# EAGLE design w076oAsBuilt (EAGLE 6.6.0)
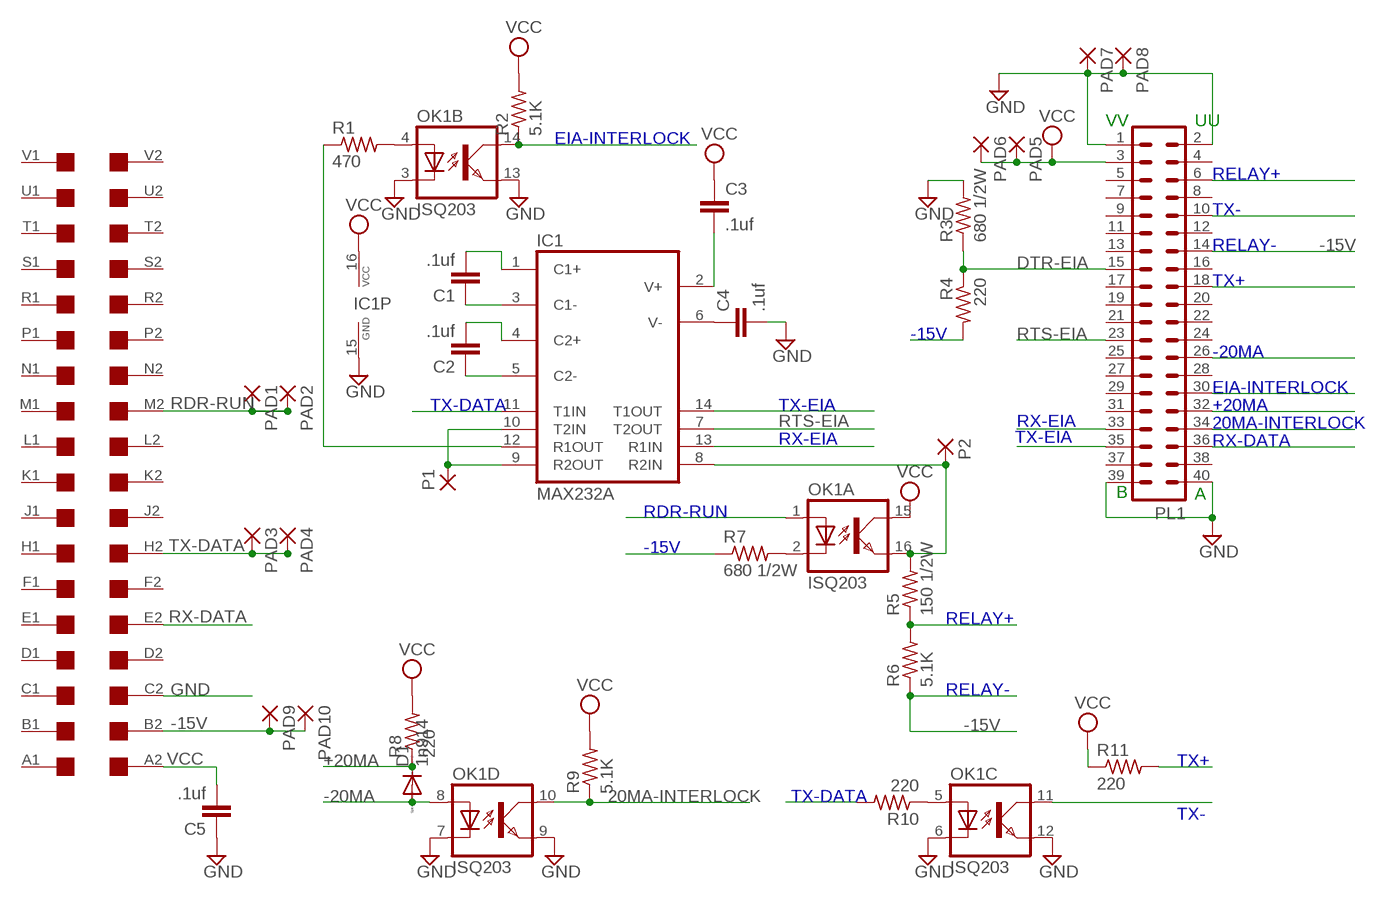
[diagram p0: schematic, sheet 1]

## Parts
C1  .1uf  C-EU050-025X075  [C050-025X075]
C2  .1uf  C-EU050-025X075  [C050-025X075]
C3  .1uf  C-EU050-025X075  [C050-025X075]
C4  .1uf  C-EU050-025X075  [C050-025X075]
C5  .1uf  C-EU050-025X075  [C050-025X075]
D1  1n914  1N4004  [DO41-10]
IC1  MAX232A  MAX232  [DIL16]
OK1  ISQ203  ILQ1  [DIL16]
P1  1,6/0,8  [1,6/0,8]
P2  1,6/0,8  [1,6/0,8]
PAD1  1,6/0,8  [1,6/0,8]
PAD2  1,6/0,8  [1,6/0,8]
PAD3  1,6/0,8  [1,6/0,8]
PAD4  1,6/0,8  [1,6/0,8]
PAD5  1,6/0,8  [1,6/0,8]
PAD6  1,6/0,8  [1,6/0,8]
PAD7  1,6/0,8  [1,6/0,8]
PAD8  1,6/0,8  [1,6/0,8]
PAD9  1,6/0,8  [1,6/0,8]
PAD10  1,6/0,8  [1,6/0,8]
PL1  40H  [40H]
R1  470  R-US_0207/10  [0207/10]
R2  5.1K  R-US_0207/10  [0207/10]
R3  680 1/2W  R-US_0207/12  [0207/12]
R4  220  R-US_0207/10  [0207/10]
R5  150 1/2W  R-US_0207/12  [0207/12]
R6  5.1K  R-US_0207/10  [0207/10]
R7  680 1/2W  R-US_0207/12  [0207/12]
R8  220  R-US_0207/10  [0207/10]
R9  5.1K  R-US_0207/10  [0207/10]
R10  220  R-US_0207/10  [0207/10]
R11  220  R-US_0207/10  [0207/10]
U$1  DEC-FLIPCHIP  [DEC-FLIPCHIP]

## Nets
20MA-INTERLOCK: OK1.10(D:COL) PL1.34 R9.1
+20MA: D1.C PL1.32 R8.1
-15V: PAD9.1(P) PAD10.1(P) PL1.14 R4.2 R6.1 R7.1 U$1.B2
-20MA: D1.A OK1.8(D:A) PL1.26
DTR-EIA: PL1.15 R3.1 R4.1
EIA-INTERLOCK: OK1.14(B:COL) PL1.30 R2.1
GND: C4.2 C5.1 IC1.15(GND) OK1.3(B:C) OK1.6(C:C) OK1.7(D:C) OK1.9(D:EMIT) OK1.12(C:EMIT) OK1.13(B:EMIT) PAD7.1(P) PAD8.1(P) PL1.1 PL1.2 PL1.39 PL1.40 R3.2 U$1.C2
N$1: C2.1 IC1.5(C2-)
N$2: C2.2 IC1.4(C2+)
N$3: C1.2 IC1.1(C1+)
N$4: C1.1 IC1.3(C1-)
N$5: OK1.2(A:C) R7.2
N$6: IC1.9(R2OUT) IC1.10(T2IN) P1.1(P)
N$7: IC1.8(R2IN) OK1.16(A:EMIT) P2.1(P) R5.2
N$8: IC1.12(R1OUT) R1.1
N$9: C3.2 IC1.2(V+)
N$10: C4.1 IC1.6(V-)
N$11: OK1.4(B:A) R1.2
N$15: OK1.5(C:A) R10.1
RDR-RUN: OK1.1(A:A) PAD1.1(P) PAD2.1(P) U$1.M2
RELAY+: PL1.6 R5.1 R6.2
RTS-EIA: IC1.7(T2OUT) PL1.23
RX-DATA: PL1.36 U$1.E2
RX-EIA: IC1.13(R1IN) PL1.33
TX+: PL1.18 R11.2
TX-: OK1.11(C:COL) PL1.10
TX-DATA: IC1.11(T1IN) PAD3.1(P) PAD4.1(P) R10.2 U$1.H2
TX-EIA: IC1.14(T1OUT) PL1.35
VCC: C3.1 C5.2 IC1.16(VCC) OK1.15(A:COL) PAD5.1(P) PAD6.1(P) PL1.3 R2.2 R8.2 R9.2 R11.1 U$1.A2
Unconnected: PL1.4 PL1.5 PL1.7 PL1.8 PL1.9 PL1.11 PL1.12 PL1.13 PL1.16 PL1.17 PL1.19 PL1.20 PL1.21 PL1.22 PL1.24 PL1.25 PL1.27 PL1.28 PL1.29 PL1.31 PL1.37 PL1.38 U$1.A1 U$1.B1 U$1.C1 U$1.D1 U$1.D2 U$1.E1 U$1.F1 U$1.F2 U$1.H1 U$1.J1 U$1.J2 U$1.K1 U$1.K2 U$1.L1 U$1.L2 U$1.M1 U$1.N1 U$1.N2 U$1.P1 U$1.P2 U$1.R1 U$1.R2 U$1.S1 U$1.S2 U$1.T1 U$1.T2 U$1.U1 U$1.U2 U$1.V1 U$1.V2

## Notes on the sheet
- VV | UU
- EIA-INTERLOCK
- RELAY+
- TX-
- RELAY-
- TX+
- -15V
- -20MA
- EIA-INTERLOCK
- TX-DATA | TX-EIA | +20MA
- RX-EIA | 20MA-INTERLOCK
- RX-EIA | TX-EIA | RX-DATA
- B | A
- RDR-RUN
- -15V
- RELAY+
- RELAY-
- TX+
- TX-DATA
- TX-

## Library data of the parts
C1-C5 = rcl:C-EU: CAPACITOR, European symbol
D1 = diode:1N4004: DIODE general purpose rectifier, 1 A
IC1 = maxim:MAX232: RS232 TRANSCEIVER; MF: MAXIM; MPN: MAX232ACPE+; OC_FARNELL: 9723773; OC_NEWARK: 68K4544
OK1 = optocoupler:ILQ1: SIEMENS OPTO COUPLER; MF: VISHAY/TELEFUNKEN; MPN: ILQ1; OC_FARNELL: 1469501; OC_NEWARK: 88K1954
P1 P2 PAD1-PAD10 = wirepad:1,6/0,8: THROUGH-HOLE PAD
PL1 = con-harting-h:40H: CONNECTOR; OC_FARNELL: unknown; OC_NEWARK: unknown
R1-R11 = rcl:R-US_: RESISTOR, American symbol
U$1 = con-dec:DEC-FLIPCHIP: DEC Flip-Chip single card fingers

## Board
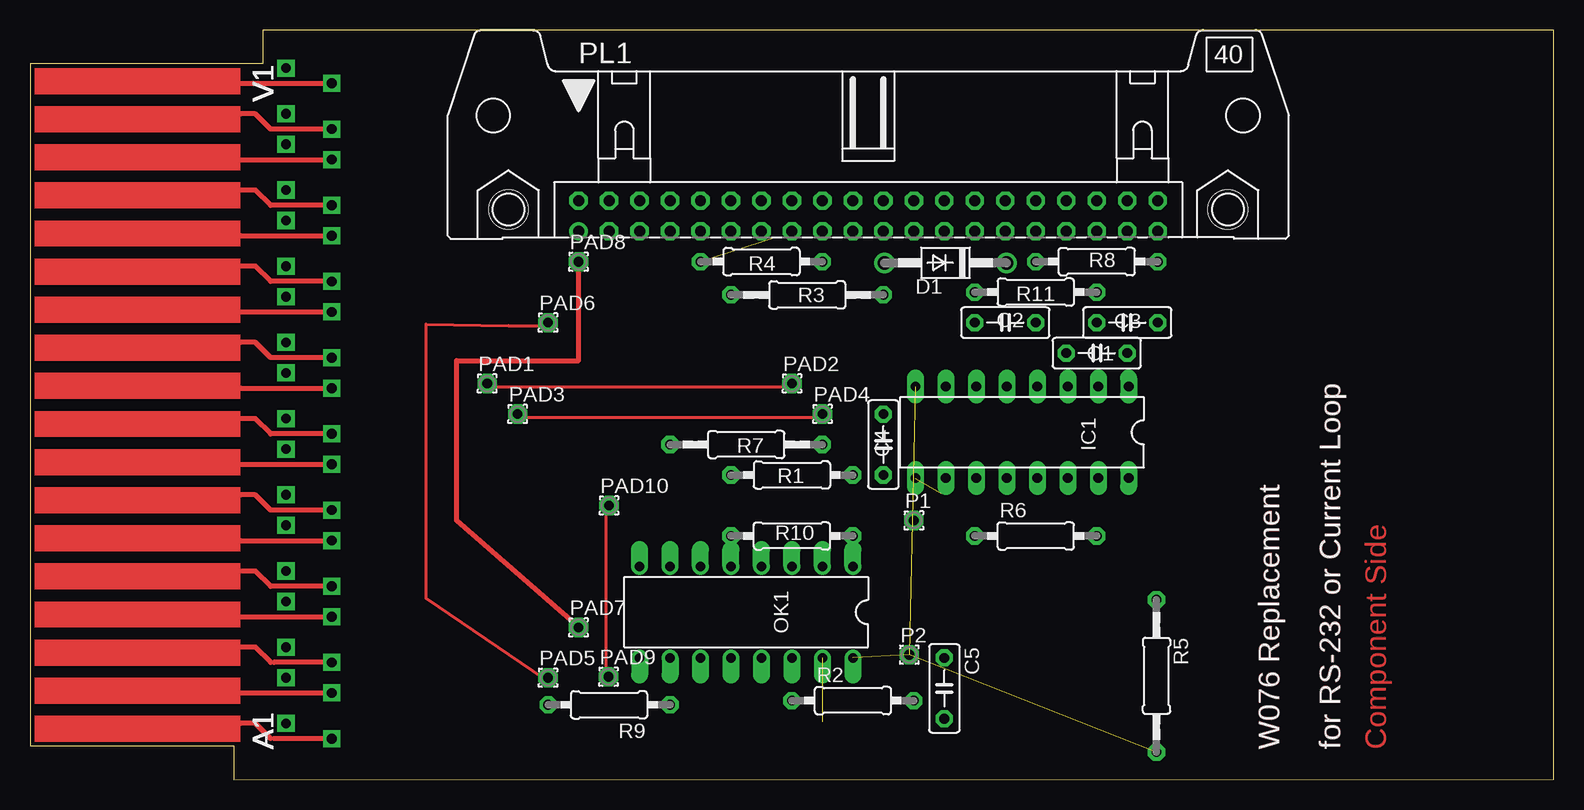
[diagram p1: board, top side]
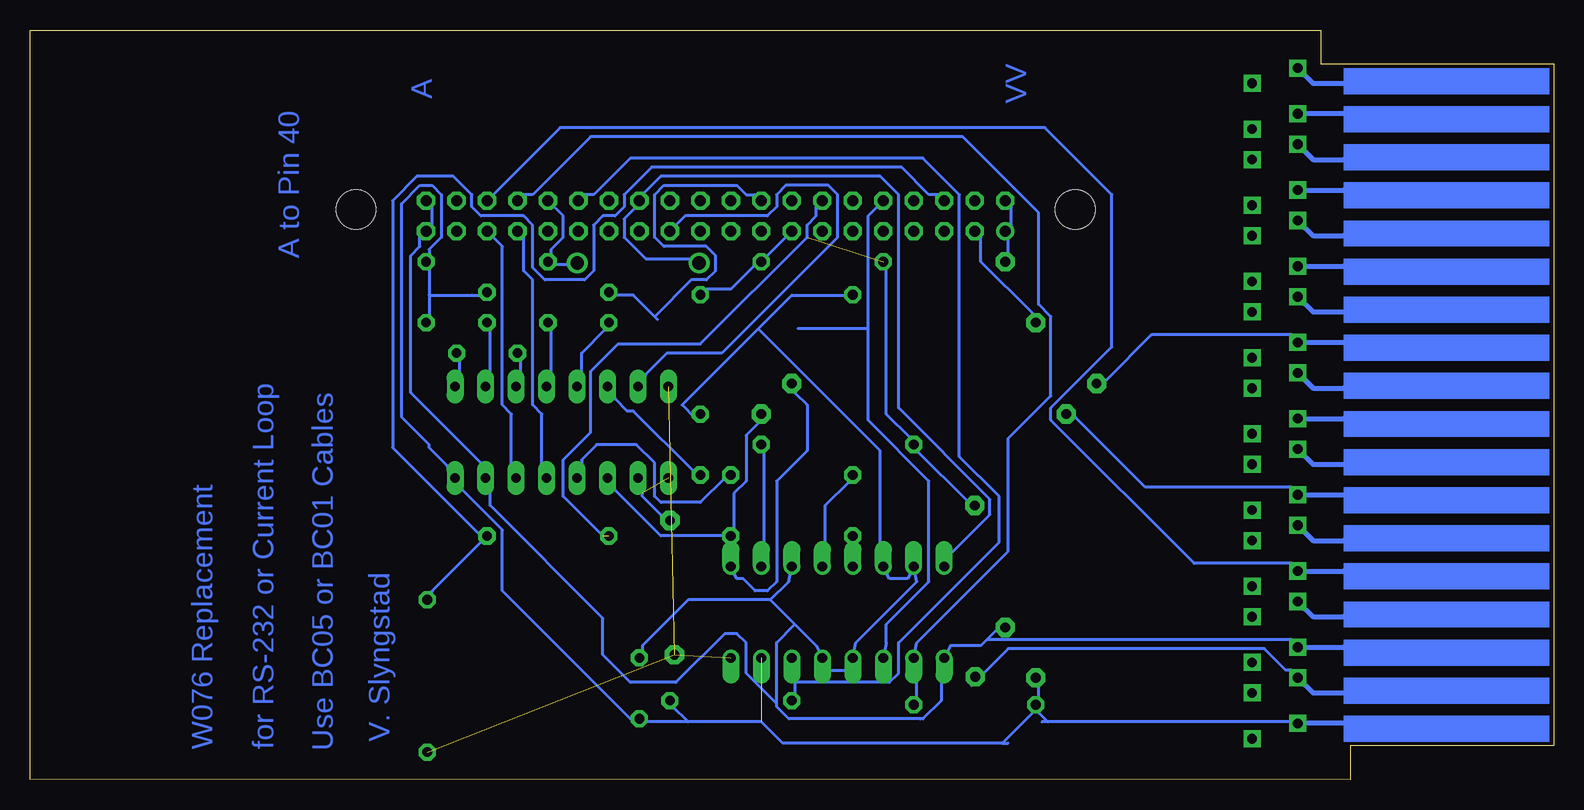
[diagram p2: board, bottom side, seen from below]

Size 126.98 x 62.48 mm. Coordinates in mm from the lower left corner, seen from the top.
Outline: 0,2.83 16.96,2.83 16.96,0 126.98,0.04 126.98,62.45 19.4,62.48 19.4,59.65 0,59.65 0,2.83
Copper layers (1*16): Top 0.035mm / dielectric 1.5mm / Bottom 0.035mm
Design rules "10mils": minimum track width 10mil, minimum drill 28mil, track to track 15mil, track to pad 10mil, pad to pad 10mil, via to via 10mil, smd to smd 10mil, copper to edge 40mil, drill to drill 10mil, minimum pad ring 12mil, minimum via ring 8mil, stop-mask expansion 0mil, vias tented up to drill 0mil, thermal gap 10mil

### Footprints (pad centres in the part's own frame; a part is rotated, then mirrored left to right if it is on the bottom)
C050-025X075 = drill 0.813 octagon: 1 -2.54,0; 2 2.54,0
DO41-10 = drill 1.118: A 5.08,0; C -5.08,0
DIL16 = drill 0.813 long: 1 -8.89,-3.81; 2 -6.35,-3.81; 3 -3.81,-3.81; 4 -1.27,-3.81; 5 1.27,-3.81; 6 3.81,-3.81; 7 6.35,-3.81; 8 8.89,-3.81; 9 8.89,3.81; 10 6.35,3.81; 11 3.81,3.81; 12 1.27,3.81; 13 -1.27,3.81; 14 -3.81,3.81; 15 -6.35,3.81; 16 -8.89,3.81
DIL16' = drill 0.813 offset: 1 -8.89,-3.81; 2 -6.35,-3.81; 3 -3.81,-3.81; 4 -1.27,-3.81; 5 1.27,-3.81; 6 3.81,-3.81; 7 6.35,-3.81; 8 8.89,-3.81; 9 8.89,3.81; 10 6.35,3.81; 11 3.81,3.81; 12 1.27,3.81; 13 -1.27,3.81; 14 -3.81,3.81; 15 -6.35,3.81; 16 -8.89,3.81
1,6/0,8 = drill 0.813 pad 1.6 octagon: 1 0,0
40H = drill 0.914: 1 -24.13,-1.27 | drill 0.914 octagon: 2 -24.13,1.27; 3 -21.59,-1.27; 4 -21.59,1.27; 5 -19.05,-1.27; 6 -19.05,1.27; 7 -16.51,-1.27; 8 -16.51,1.27; 9 -13.97,-1.27; 10 -13.97,1.27; 11 -11.43,-1.27; 12 -11.43,1.27; 13 -8.89,-1.27; 14 -8.89,1.27; 15 -6.35,-1.27; 16 -6.35,1.27; 17 -3.81,-1.27; 18 -3.81,1.27; 19 -1.27,-1.27; 20 -1.27,1.27; 21 1.27,-1.27; 22 1.27,1.27; 23 3.81,-1.27; 24 3.81,1.27; 25 6.35,-1.27; 26 6.35,1.27; 27 8.89,-1.27; 28 8.89,1.27; 29 11.43,-1.27; 30 11.43,1.27; 31 13.97,-1.27; 32 13.97,1.27; 33 16.51,-1.27; 34 16.51,1.27; 35 19.05,-1.27; 36 19.05,1.27; 37 21.59,-1.27; 38 21.59,1.27; 39 24.13,-1.27; 40 24.13,1.27 | hole 3.302: -29.972,0.533; 29.972,0.533
0207/10 = drill 0.813 octagon: 1 -5.08,0; 2 5.08,0
0207/12 = drill 0.813 octagon: 1 -6.35,0; 2 6.35,0
DEC-FLIPCHIP = drill 0.813 square: A1 -7.62,27.94; A2 -3.81,26.67; B1 -7.62,24.13; B2 -3.81,22.86; C1 -7.62,21.59; C2 -3.81,20.32; D1 -7.62,17.78; D2 -3.81,16.51; E1 -7.62,15.24; E2 -3.81,13.97; F1 -7.62,11.43; F2 -3.81,10.16; H1 -7.62,8.89; H2 -3.81,7.62; J1 -7.62,5.08; J2 -3.81,3.81; K1 -7.62,2.54; K2 -3.81,1.27; L1 -7.62,-1.27; L2 -3.81,-2.54; M1 -7.62,-3.81; M2 -3.81,-5.08; N1 -7.62,-7.62; N2 -3.81,-8.89; P1 -7.62,-10.16; P2 -3.81,-11.43; R1 -7.62,-13.97; R2 -3.81,-15.24; S1 -7.62,-16.51; S2 -3.81,-17.78; T1 -7.62,-20.32; T2 -3.81,-21.59; U1 -7.62,-22.86; U2 -3.81,-24.13; V1 -7.62,-26.67; V2 -3.81,-27.94

### Placement (x,y rotation side)
C1  88.9,35.56 0 top
C2  81.28,38.1 0 top
C3  91.44,38.1 180 top
C4  71.12,27.94 90 top
C5  76.2,7.62 270 top
D1  76.3,43.08 180 top
IC1  82.67,28.96 180 top
OK1  ISQ203  [DIL16']  59.68,13.97 180 top
P1  73.66,21.62 0 top
P2  73.27,10.41 0 top
PAD1  38.09,33.02 0 top
PAD2  63.49,33.02 0 top
PAD3  40.63,30.48 0 top
PAD4  66.04,30.48 0 top
PAD5  43.17,8.51 0 top
PAD6  43.17,38.1 0 top
PAD7  45.71,12.7 0 top
PAD8  45.71,43.18 0 top
PAD9  48.2,8.59 0 top
PAD10  48.25,22.86 0 top
PL1  69.84,46.99 0 top
R1  63.49,25.4 180 top
R2  68.58,6.6 0 top
R3  64.77,40.41 180 top
R4  60.95,43.18 180 top
R5  93.87,8.66 270 top
R6  83.81,20.32 0 top
R7  59.68,27.94 0 top
R8  88.9,43.18 0 top
R9  48.25,6.25 180 top
R10  63.49,20.32 0 top
R11  83.81,40.64 180 top
U$1  17.52,31.37 180 top

### Tracks (layer width: path | path; a pad name or v marks a point on that pad's centre or on a via)
20MA-INTERLOCK
  Bottom 0.254: PL1.34 85.85,48.77 85.09,48.77 80.26,53.59 49.27,53.59 42.92,47.24 42.92,39.62 41.9,38.61 41.9,32 45.46,28.45 45.46,19.05 53.08,11.43 OK1.10 53.08,8.89 53.08,6.86 R9.1
+20MA
  Bottom 0.254: PL1.32 82.55,46.99 82.55,45.21 83.56,44.2 83.56,43.69 R8.1 83.31,42.93 82.04,42.93 D1.C
-15V  (2 unrouted)
  Top 0.254: PAD9.1 48,8.38 48,22.1 PAD10.1
  Bottom 0.254: PAD10.1 48.76,23.11 53.08,27.43 R7.1 53.59,28.45 55.62,30.48 55.62,42.67 R4.2 | U$1.B2 21.84,9.14 22.35,9.14 24.12,10.92 45.46,10.92 47.49,8.89 PAD9.1 | PAD9.1 48.76,8.13 | PAD9.1 48.51,7.87 | 78.23,20.07 R6.1 78.48,19.81 | 79.24,20.32 82.55,23.62 82.55,26.67 80.26,28.96 80.26,34.04 77.97,36.32 71.12,36.32 62.22,45.21 62.22,46.23 61.46,46.99 61.46,47.75 PL1.14
-20MA
  Bottom 0.254: OK1.8 50.29,18.8 46.98,22.1 46.98,23.37 54.6,30.99 54.6,48.77 56.13,50.29 74.42,50.29 75.94,48.77 PL1.26 76.45,47.75 77.47,46.74 77.47,45.21 75.69,43.43 71.88,43.43 D1.A
DTR-EIA
  Bottom 0.254: PL1.15 R4.1 66.54,42.93 68.58,40.89 70.61,40.89 R3.1
EIA-INTERLOCK
  Bottom 0.254: 63.24,8.13 63.24,8.89 OK1.14 | 63.24,8.13 55.37,8.13 54.6,8.89 54.6,11.43 46.22,19.81 46.22,23.62 49.52,26.92 49.52,48.77 52.57,51.82 76.96,51.82 80.01,48.77 80.77,48.77 PL1.30 | 63.24,8.13 63.24,7.11 R2.1
GND
  Top 0.406: PAD8.1 45.71,34.92 35.55,34.92 35.55,21.59 PAD7.1
  Bottom 0.254: 70.61,30.23 C4.2 71.62,30.23 72.64,31.24 66.29,37.59 | 47.24,11.68 46.48,12.45 PAD7.1 | 47.24,11.68 47.75,11.18 50.29,11.18 OK1.9 51.05,8.89 51.05,6.6 52.57,5.08 52.83,5.08 | 47.24,11.68 21.84,11.68 U$1.C2 | PL1.40 93.47,47.75 93.47,46.23 PL1.39 94.48,45.21 94.48,44.45 95.25,43.69 95.25,32.26 89.4,26.42 IC1.15 88.64,23.88 88.64,22.86 79.24,13.46 79.24,10.41 76.96,8.13 73.15,8.13 69.08,12.19 68.07,12.19 67.31,11.43 67.31,8.89 64.77,6.35 | PAD8.1 45.46,43.94 45.46,45.21 PL1.1 45.21,46.23 45.21,47.75 PL1.2 | 66.29,37.59 63.49,40.39 58.92,40.39 R3.2 | 66.29,37.59 56.13,27.43 56.13,19.05 OK1.6 55.37,16.76 53.84,16.76 OK1.7 53.08,16.51 58.16,11.43 OK1.12 58.92,9.14 60.45,9.14 OK1.13 61.46,11.18 63.24,12.95 | 65.27,14.99 72.13,14.99 75.94,11.18 75.94,10.67 C5.1 | 65.27,14.99 63.75,16.51 OK1.3 | 63.24,12.95 65.27,14.99 | 63.24,12.95 64.77,11.43 64.77,6.35 | 64.77,6.35 64.77,6.1 63.75,5.08 52.83,5.08 | 52.83,5.08 52.75,5.11
N$1
  Bottom 0.254: IC1.5 81.02,34.04 81.02,35.56 78.99,37.59 C2.1
N$2
  Bottom 0.254: IC1.4 83.56,34.04 83.56,37.59 C2.2
N$3
  Bottom 0.254: IC1.1 91.18,34.04 91.18,35.05 C1.2
N$4
  Bottom 0.254: IC1.3 86.1,34.04 86.1,35.05 C1.1
N$5
  Bottom 0.254: OK1.2 65.78,19.05 65.78,27.43 R7.2
N$6  (1 unrouted)
  Bottom 0.254: IC1.10 75.94,23.88 75.94,23.62 74.16,21.84 P1.1
N$7  (3 unrouted)
N$8
  Bottom 0.254: IC1.12 81.02,26.42 81.02,26.67 79.75,27.94 76.45,27.94 74.93,26.42 74.93,23.62 74.42,23.11 71.12,23.11 69.08,25.15 R1.1
N$9
  Bottom 0.254: IC1.2 88.64,34.04 88.64,37.59 C3.2
N$10
  Bottom 0.254: C4.1 71.62,25.65 76.7,30.73 77.21,30.73 78.23,31.75 IC1.6
N$11
  Bottom 0.254: OK1.4 60.7,19.05 60.7,22.86 58.67,24.89 R1.2
N$15
  Bottom 0.254: OK1.5 58.16,19.05 58.16,19.81 R10.1
RDR-RUN
  Top 0.254: PAD1.1 38.86,32.77 62.73,32.77 PAD2.1
  Bottom 0.254: U$1.M2 21.84,37.08 33.52,37.08 37.33,33.27 PAD1.1 | OK1.1 68.07,16.76 67.56,16.76 66.54,15.75 65.53,15.75 64.77,16.51 64.77,24.89 62.22,27.43 62.22,31.24 63.24,32.26 PAD2.1
RELAY+
  Bottom 0.254: R6.2 89.4,20.07 | PL1.6 51.3,48.77 52.06,48.77 54.35,51.05 75.18,51.05 77.47,48.77 77.47,47.75 78.23,46.99 79.24,46.99 80.01,46.23 80.01,42.42 80.77,41.66 84.07,41.66 85.09,42.67 85.09,46.23 85.85,46.99 89.4,46.99 90.17,47.75 90.17,48.77 91.69,50.29 94.74,50.29 96.77,48.26 96.77,27.69 89.4,20.32 R6.2 | R5.1 93.47,15.75 R6.2
RTS-EIA
  Bottom 0.254: IC1.7 75.69,33.78 73.91,35.56 69.34,35.56 59.68,45.21 59.68,48.77 60.45,49.53 64,49.53 64.77,48.77 64.77,47.75 65.53,46.99 72.39,46.99 PL1.23
RX-DATA
  Bottom 0.254: U$1.E2 21.84,18.03 29.97,18.03 41.9,29.97 41.9,30.99 36.82,36.07 36.82,48.77 42.41,54.36 82.8,54.36 PL1.36
RX-EIA
  Bottom 0.254: IC1.13 84.32,26.42 84.32,30.48 85.09,31.24 85.09,41.66 85.85,42.42 85.85,45.21 PL1.33
TX+
  Bottom 0.254: 74.93,38.61 74.67,38.35 | 74.93,38.61 76.7,40.39 78.23,40.39 R11.2 | 74.93,38.61 71.88,41.66 70.61,41.66 69.84,42.42 69.84,43.69 70.61,44.45 74.16,44.45 74.93,45.21 74.93,48.77 74.16,49.53 68.07,49.53 67.31,48.77 66.54,48.77 PL1.18
TX-
  Bottom 0.254: 57.14,37.59 57.14,29.97 52.06,24.89 52.06,16.51 55.62,12.95 55.62,11.43 OK1.11 | 57.14,37.59 57.14,46.99 PL1.10 | 57.14,37.59 62.99,37.59
TX-DATA
  Top 0.254: PAD4.1 65.27,30.23 41.4,30.23 PAD3.1
  Bottom 0.254: R10.2 69.08,20.57 | U$1.H2 21.84,24.38 34.03,24.38 39.87,30.23 PAD3.1 | R10.2 68.32,20.83 68.32,23.88 67.31,24.89 67.31,28.7 66.29,29.72 PAD4.1 | IC1.11 78.23,24.13 74.42,20.32 R10.2
TX-EIA
  Bottom 0.254: IC1.14 86.86,26.42 86.86,30.48 87.62,31.24 87.62,44.45 PL1.35
VCC  (1 unrouted)
  Top 0.254: PAD6.1 42.41,37.85 39.87,37.85 33.02,37.97 33.02,15.11 42.92,8.38 PAD5.1
  Bottom 0.254: 42.16,4.83 21.84,4.83 U$1.A2 | 42.16,4.83 42.67,4.83 | 93.72,40.39 93.72,42.67 R8.2 93.72,43.69 93.72,44.2 92.7,45.21 92.7,48.77 93.47,49.53 94.48,49.53 96.01,48.01 96.01,30.23 93.72,27.94 93.72,27.69 92.2,26.16 IC1.16 90.93,24.13 87.62,20.83 87.62,15.75 76.7,4.83 C5.2 | 93.72,40.39 93.72,38.61 C3.1 | 93.72,40.39 90.17,40.39 89.4,40.39 R11.1 | C5.2 75.69,4.83 72.13,4.83 | PL1.3 47.75,45.21 47.75,43.18 43.43,38.86 PAD6.1 | 45.97,3.05 45.46,3.05 | 45.97,3.05 64.26,3.05 66.04,4.83 72.13,4.83 | 42.16,4.83 42.92,5.59 R9.2 | R9.2 42.92,6.86 42.92,7.87 PAD5.1 | 45.97,3.05 43.43,5.59 R9.2 | C5.2 76.45,5.59 | 72.13,4.83 73.4,6.1 R2.2

### Text on the board
Top: W076 Replacement | for RS-232 or Current Loop | Component Side
Bottom: VV | A | A to Pin 40 | V. Slyngstad | for RS-232 or Current Loop | W076 Replacement | Use BC05 or BC01 Cables
tPlace: W076 Replacement | for RS-232 or Current Loop
tNames: V1 | V1 | V1 | V1 | V1 | V1 | V1 | V1 | V1 | V1 | V1 | V1 | V1 | V1 | V1 | V1 | V1 | V1 | V1 | V1 | V1 | V1 | V1 | V1 | V1 | V1 | V1 | V1 | V1 | V1 | V1 | V1 | A1 | A1 | A1 | A1 | A1 | A1 | A1 | A1 | A1 | A1 | A1 | A1 | A1 | A1 | A1 | A1 | A1 | A1 | A1 | A1 | A1 | A1 | A1 | A1 | A1 | A1 | A1 | A1 | A1 | A1 | A1 | A1
_tplace: 1n914 | 220 | 220 | 220 | MAX232A | 680 1/2W | 220 | 220 | 5.1K | ISQ203 | .1uf | 5.1K | 5.1K
_layer121: PL1 | PL1 | 40 | 40 | V1 | V1 | V1 | V1 | V1 | V1 | V1 | V1 | V1 | V1 | V1 | V1 | V1 | V1 | V1 | V1 | V1 | V1 | V1 | V1 | V1 | V1 | V1 | V1 | V1 | V1 | V1 | V1 | V1 | V1 | V1 | V1 | V1 | V1 | V1 | V1 | V1 | V1 | V1 | V1 | V1 | V1 | V1 | V1 | V1 | V1 | V1 | V1 | V1 | V1 | V1 | V1 | V1 | V1 | V1 | V1 | V1 | V1 | V1 | V1 | V1 | V1 | V1 | V1 | 1n914 | 1n914 | R8 | R8 | PAD8 | PAD8 | 220 | 220 | 220 | 220 | R4 | R4 | 680 1/2W | 680 1/2W | 1n914 | 1n914 | D1 | D1 | 220 | 220 | .1uf | .1uf | C2 | C2 | PAD6 | PAD6 | R3 | R3 | R11 | R11 | C1 | C1 | D2 | D2 | C3 | C3 | .1uf | .1uf | PAD1 | PAD1 | PAD2 | PAD2 | .1uf | .1uf | IC1 | IC1 | PAD3 | PAD3 | PAD4 | PAD4 | MAX232A | MAX232A | R7 | R7 | 680 1/2W | 680 1/2W | 220 | 220 | C4 | C4 | .1uf | .1uf | PAD10 | PAD10 | R1 | R1 | R10 | R10 | R6 | R6 | 220 | 220 | 5.1K | 5.1K | 150 1/2W | 150 1/2W | 1n914 | 1n914 | D4 | D4 | R5 | R5 | OK1 | OK1 | ISQ203 | ISQ203 | PAD7 | PAD7 | .1uf | .1uf | C5 | C5 | PAD5 | PAD5 | PAD9 | PAD9 | R2 | R2 | 5.1K | 5.1K | 5.1K | 5.1K | R9 | R9 | A1 | A1 | A1 | A1 | A1 | A1 | A1 | A1 | A1 | A1 | A1 | A1 | A1 | A1 | A1 | A1 | A1 | A1 | A1 | A1 | A1 | A1 | A1 | A1 | A1 | A1 | A1 | A1 | A1 | A1 | A1 | A1 | A1 | A1 | A1 | A1 | A1 | A1 | A1 | A1 | A1 | A1 | A1 | A1 | A1 | A1 | A1 | A1 | A1 | A1 | A1 | A1 | A1 | A1 | A1 | A1 | A1 | A1 | A1 | A1 | A1 | A1 | A1 | A1 | W076 Replacement | W076 Replacement | for RS-232 or Current Loop | for RS-232 or Current Loop